# Altium schematic sheet INPUTS.SchDoc
size A4
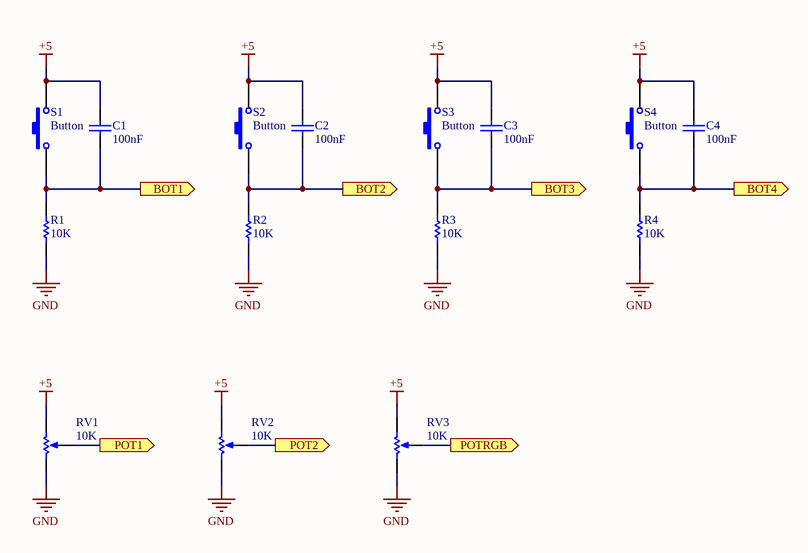
[diagram p0: INPUTS.SchDoc]

## Parts
C1  100nF  [SMD Capacitor]
C2  100nF  [SMD Capacitor]
C3  100nF  [SMD Capacitor]
C4  100nF  [SMD Capacitor]
R1  10K  [SMD Resistor]
R2  10K  [SMD Resistor]
R3  10K  [SMD Resistor]
R4  10K  [SMD Resistor]
RV1  10K  [Trimpot]
RV2  10K  [Trimpot]
RV3  10K  [Trimpot]
S1  Button  [BUTTON]
S2  Button  [BUTTON]
S3  Button  [BUTTON]
S4  Button  [BUTTON]

## Ports
BOT1 (out), BOT2 (out), BOT3 (out), BOT4 (out), POT1 (out), POT2 (out), POTRGB (out)

## Nets
+5: C1.2 C2.2 C3.2 C4.2 RV1.1(TOP) RV2.1(TOP) RV3.1(TOP) S1.2 S2.2 S3.2 S4.2
GND: R1.1 R2.1 R3.1 R4.1 RV1.3(BOT) RV2.3(BOT) RV3.3(BOT)
BOT1: C1.1 R1.2 S1.1 ; port BOT1
BOT2: C2.1 R2.2 S2.1 ; port BOT2
BOT3: C3.1 R3.2 S3.1 ; port BOT3
BOT4: C4.1 R4.2 S4.1 ; port BOT4
POT1: RV1.2(TAP) ; port POT1
POT2: RV2.2(TAP) ; port POT2
POTRGB: RV3.2(TAP) ; port POTRGB

## Library data of the parts
C1-C4 = SMD Capacitor: Multilayer Ceramic / Capacitor 0805; ComponentLink1Description: Multilayer Ceramic; ComponentLink1URL: https://eu.mouser.com/datasheet/2/212/KEM_C1062_C0G_FT-CAP_SMD-1101746.pdf
R1-R4 = SMD Resistor: SMD Resistor  MCU 0805
RV1-RV3 = Trimpot: TRIMMER 10K OHM 0.5W TH; Manufacturer: Murata; Manufacturer Part Number: PV36W103C01B00; Resistance: 10kR; Tolerance: 10%; Number of Turns: 25; Max Power Dissipation: 500mW; Temperature Coefficient: 100ppm/°C; Pitch: 2.5mm; Supplier 1: Arrow; Stock 1: 0; Pricing 1: 1=0.78 (EUR); Mount: Through Hole; Weight: 1g; Colour: Grey; Min Operating Temperature: -55°C; Max Operating Temperature: 125°C; Packaging: Bulk; Composition: Cermet; Termination: Pin; Power Rating: 500mW; Package Quantity: 50; Taper: Linear; Military Standard: Not; Type: Potentiometer; Length: 9.6mm; Height: 0.394inch; Width: 10mm; Depth: 5mm; Radiation Hardening: No; REACH SVHC: No SVHC; Lead Free: Lead Free; ComponentLink1URL: https://datasheet.ciiva.com/2155/l0060e-2155893.pdf; ComponentLink1Description: https://datasheet.ciiva.com/2155/l0060e-2155893.pdf; ComponentLink2URL: https://datasheet.ciiva.com/27054/1875466-27054391.pdf; ComponentLink2Description: https://datasheet.ciiva.com/27054/1875466-27054391.pdf; ComponentLink3URL: https://datasheet.ciiva.com/11830/0900766b80f10a07-11830940.pdf; ComponentLink3Description: https://datasheet.ciiva.com/11830/0900766b80f10a07-11830940.pdf; ComponentLink4URL: https://datasheet.ciiva.com/16480/r50e-16480015.pdf; ComponentLink4Description: https://datasheet.ciiva.com/16480/r50e-16480015.pdf; ComponentLink5URL: https://datasheet.ciiva.com/26329/422323-da-01-en-cermet-trimmer-pv-36w-10k0-10pr-26329725.pdf; ComponentLink5Description: https://datasheet.ciiva.com/26329/422323-da-01-en-cermet-trimmer-pv-36w-10k0-10pr-26329725.pdf; Supplier Part Number 1: PV36W103C01B00
S1-S4 = Button: Tactil Switch; Manufacturer: Panasonic; Manufacturer Part Number: EVQ-PAC07K; Mechanical Life: 100000Cycles; Max Current Rating: 20mA; Operating Force: 1N; Throw Configuration: SPST; Voltage Rating (DC): 15V; Contact Resistance: 50mR; Illumination Type: Non-Illuminated,Illuminated; Switch Travel: 0.25mm; Switch Function: Off-Mom; Actuator Length: 3.1mm; Size: 6x6x5mm; Supplier 1: Digi-Key; Stock 1: 36840; Pricing 1: 1=0.2, 10=0.196, 25=0.1896, 50=0.1828, 100=0.1726, 250=0.1625, 500=0.1557, 1000=0.1185, 5000=0.0982 (USD); Mount: Through Hole; Colour: Black; Contact Plating: Gold,Silver; Min Operating Temperature: -20°C; Max Operating Temperature: 70°C; Packaging: Bulk; Max Voltage Rating (DC): 15V; Current Rating: 20mA; Package Quantity: 500; Termination: PC Pins; Electrical Life: 100000Cycles; Contact Current Rating: 20mA; Orientation: Straight; Length: 6mm; Height: 7mm; Width: 6mm; Depth: 7.8mm; Radiation Hardening: No; REACH SVHC: Unknown; Lead Free: Lead Free; ComponentLink1URL: https://datasheet.ciiva.com/17027/70270700-17027701.pdf; ComponentLink1Description: https://datasheet.ciiva.com/17027/70270700-17027701.pdf; ComponentLink2URL: https://datasheet.ciiva.com/15184/getdatasheetpartid-174669-15184695.pdf; ComponentLink2Description: https://datasheet.ciiva.com/15184/getdatasheetpartid-174669-15184695.pdf; ComponentLink3URL: https://datasheet.ciiva.com/8166/atk0000ce10-8166344.pdf; ComponentLink3Description: https://datasheet.ciiva.com/8166/atk0000ce10-8166344.pdf; ComponentLink4URL: https://datasheet.ciiva.com/30262/36atk0000ce10-30262264.pdf; ComponentLink4Description: https://datasheet.ciiva.com/30262/36atk0000ce10-30262264.pdf; ComponentLink5URL: https://datasheet.ciiva.com/16695/atk0000ce10-16695929.pdf; ComponentLink5Description: https://datasheet.ciiva.com/16695/atk0000ce10-16695929.pdf; ComponentLink6URL: https://datasheet.ciiva.com/24076/atk0000ce10-33274-24076314.pdf; ComponentLink6Description: https://datasheet.ciiva.com/24076/atk0000ce10-33274-24076314.pdf; ComponentLink7URL: https://datasheet.ciiva.com/7645/atk0000ce10-7645644.pdf; ComponentLink7Description: https://datasheet.ciiva.com/7645/atk0000ce10-7645644.pdf; ComponentLink8URL: https://datasheet.ciiva.com/2899/atk0000ce10-2899661.pdf; ComponentLink8Description: https://datasheet.ciiva.com/2899/atk0000ce10-2899661.pdf; Supplier Part Number 1: P8011S-ND